# Altium schematic sheet topsheet_Controller.SchDoc
size A4
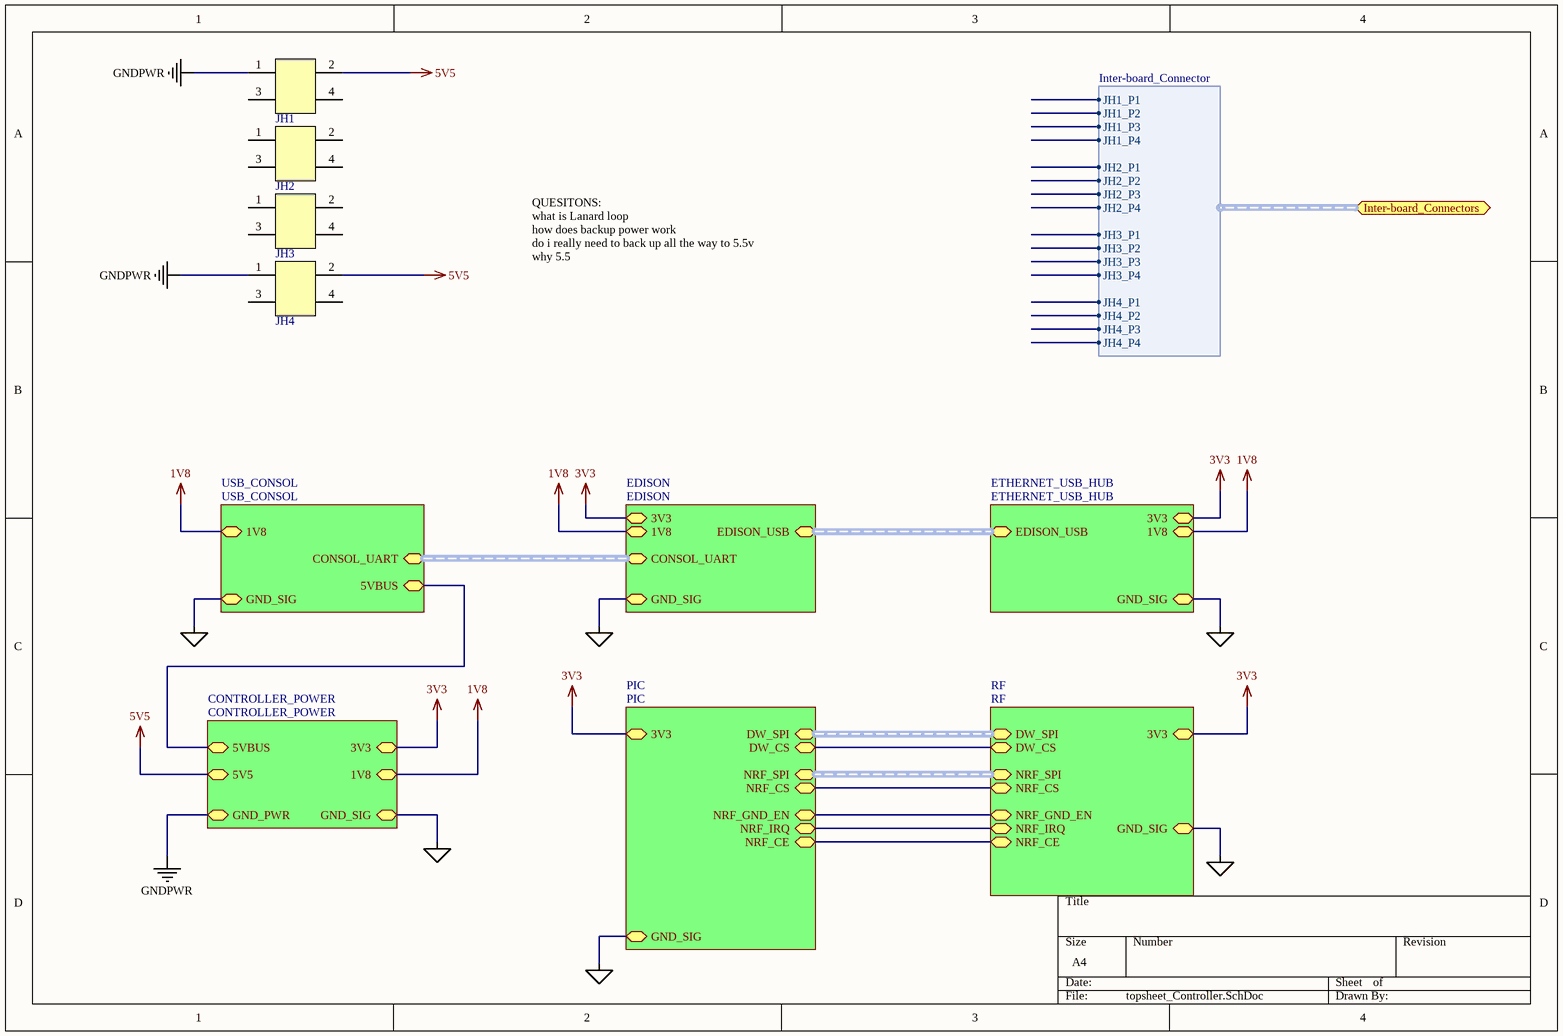
[diagram p0: topsheet_Controller.SchDoc]

## Parts
JH1  CONN HEADER 2x2POS T/H  [CONN_2x2_100MIL_MALE_SAMTEC]  (value not drawn)
JH2  CONN HEADER 2x2POS T/H  [CONN_2x2_100MIL_MALE_SAMTEC]  (value not drawn)
JH3  CONN HEADER 2x2POS T/H  [CONN_2x2_100MIL_MALE_SAMTEC]  (value not drawn)
JH4  CONN HEADER 2x2POS T/H  [CONN_2x2_100MIL_MALE_SAMTEC]  (value not drawn)

## Sub-sheets
CONTROLLER_POWER = CONTROLLER_POWER: GND_PWR, GND_SIG, 5V5, 3V3, 1V8, 5VBUS
EDISON = EDISON: CONSOL_UART (harness UART), EDISON_USB (harness EDISON_USB), GND_SIG, 1V8, 3V3
ETHERNET_USB_HUB = ETHERNET_USB_HUB: EDISON_USB (harness USB_DATA), GND_SIG, 3V3, 1V8
PIC = PIC: NRF_SPI (harness SPI), NRF_CS, DW_SPI (harness SPI), DW_CS, NRF_GND_EN, GND_SIG, 3V3, NRF_CE, NRF_IRQ
RF = RF: NRF_SPI (harness SPI), NRF_CS, DW_SPI (harness SPI), DW_CS, NRF_GND_EN, GND_SIG, 3V3, NRF_IRQ, NRF_CE
USB_CONSOL = USB_CONSOL: CONSOL_UART (harness UART), GND_SIG, 1V8, 5VBUS

## Ports
Inter-board_Connectors (harness Inter-board_Connector)

## Harnesses
Inter-board_Connector: JH1_P1, JH1_P2, JH1_P3, JH1_P4, JH2_P1, JH2_P2, JH2_P3, JH2_P4, JH3_P4, JH3_P1, JH3_P2, JH3_P3, JH4_P1, JH4_P2, JH4_P3, JH4_P4

## Nets
1V8: sheet USB_CONSOL/1V8, sheet EDISON/1V8, sheet ETHERNET_USB_HUB/1V8, sheet CONTROLLER_POWER/1V8
3V3: sheet EDISON/3V3, sheet ETHERNET_USB_HUB/3V3, sheet PIC/3V3, sheet RF/3V3, sheet CONTROLLER_POWER/3V3
5V5: JH1.2 JH4.2 ; sheet CONTROLLER_POWER/5V5
GDNSIG: sheet USB_CONSOL/GND_SIG, sheet EDISON/GND_SIG, sheet ETHERNET_USB_HUB/GND_SIG, sheet PIC/GND_SIG, sheet RF/GND_SIG, sheet CONTROLLER_POWER/GND_SIG
GNDPWR: JH1.1 JH4.1 ; sheet CONTROLLER_POWER/GND_PWR
(unnamed): sheet USB_CONSOL/5VBUS, sheet CONTROLLER_POWER/5VBUS
(unnamed): sheet PIC/NRF_CS, sheet RF/NRF_CS
(unnamed): sheet PIC/DW_CS, sheet RF/DW_CS
(unnamed): sheet PIC/NRF_GND_EN, sheet RF/NRF_GND_EN
(unnamed): sheet PIC/NRF_CE, sheet RF/NRF_CE
(unnamed): sheet PIC/NRF_IRQ, sheet RF/NRF_IRQ

Not connected (* = marked no-connect by the designer): JH1 3 4; JH2 1 2 3 4; JH3 1 2 3 4; JH4 3 4

## Buses and harness runs
harness sheet EDISON/CONSOL_UART = sheet USB_CONSOL/CONSOL_UART
harness sheet EDISON/EDISON_USB = sheet ETHERNET_USB_HUB/EDISON_USB
harness sheet PIC/DW_SPI = sheet RF/DW_SPI
harness sheet PIC/NRF_SPI = sheet RF/NRF_SPI

## Notes on the sheet
- QUESITONS:
  what is Lanard loop
  how does backup power work
  do i really need to back up all the way to 5.5v
  why 5.5

## Library data of the parts
JH1-JH4 = CONN_2x2